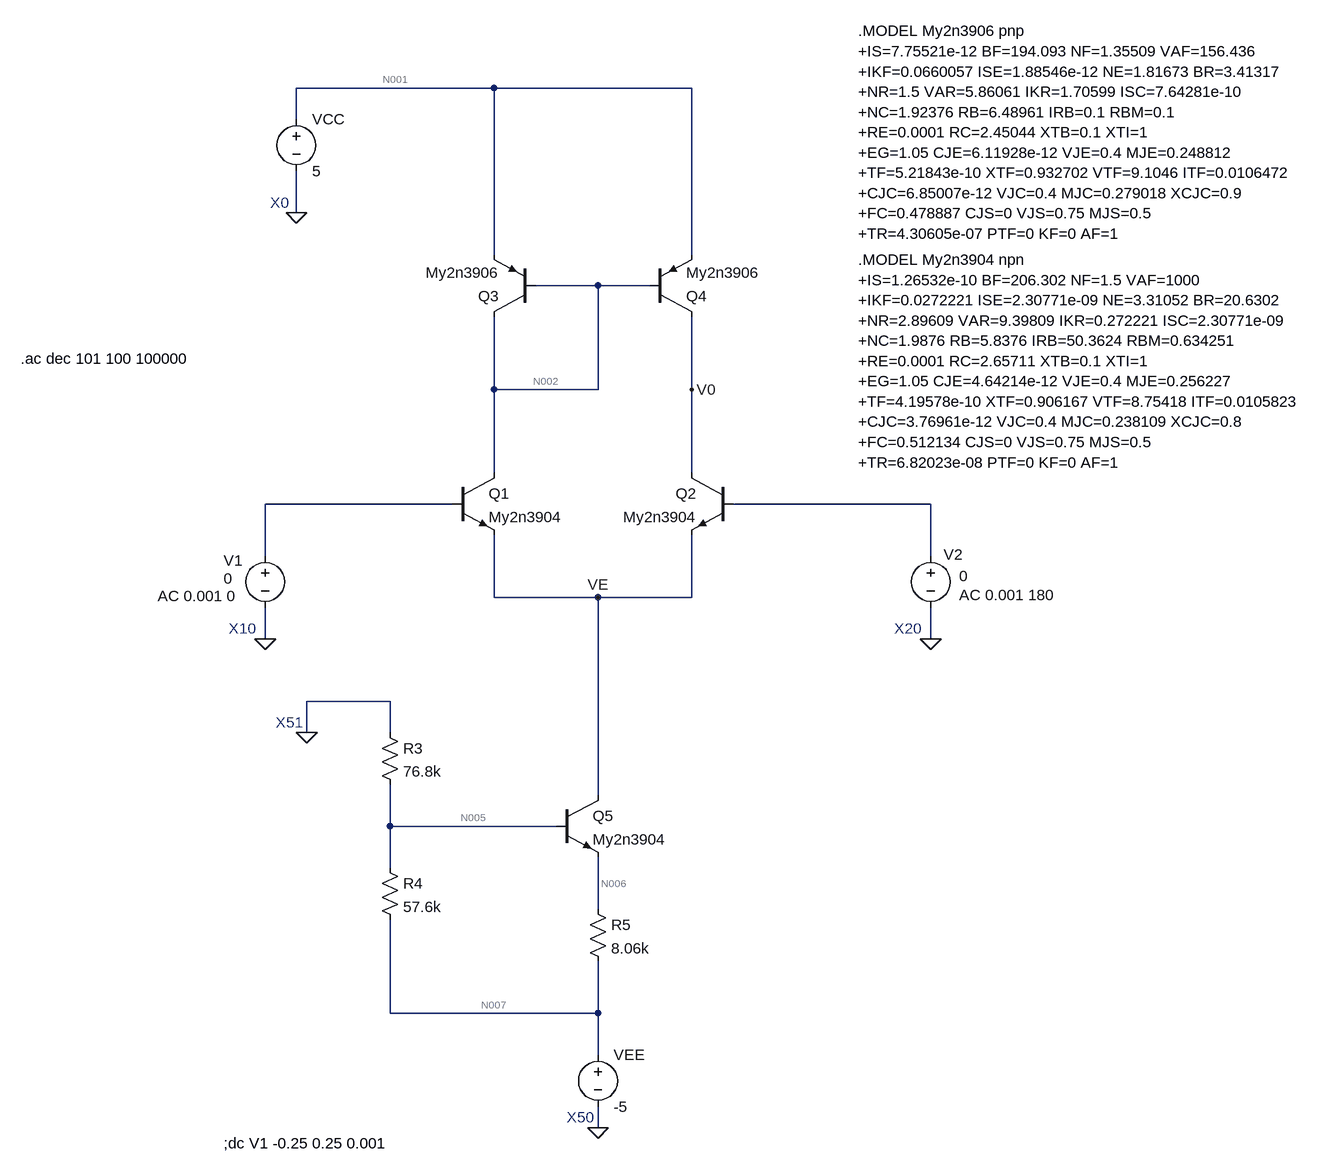
[diagram p0: schematic 3.1.asc]
3.1.asc, the LTspice schematic file:
Version 4
SHEET 1 1176 712
WIRE -128 -928 -432 -928
WIRE 176 -928 -128 -928
WIRE -432 -880 -432 -928
WIRE -432 -736 -432 -800
WIRE -128 -672 -128 -928
WIRE 176 -672 176 -928
WIRE 32 -624 -64 -624
WIRE 112 -624 32 -624
WIRE -128 -464 -128 -576
WIRE 32 -464 32 -624
WIRE 32 -464 -128 -464
WIRE 176 -464 176 -576
WIRE -128 -336 -128 -464
WIRE 176 -336 176 -464
WIRE -192 -288 -480 -288
WIRE 544 -288 240 -288
WIRE -480 -208 -480 -288
WIRE 544 -208 544 -288
WIRE -128 -144 -128 -240
WIRE 32 -144 -128 -144
WIRE 176 -144 176 -240
WIRE 176 -144 32 -144
WIRE -480 -80 -480 -128
WIRE 544 -80 544 -128
WIRE -288 16 -416 16
WIRE -416 64 -416 16
WIRE -288 64 -288 16
WIRE 32 160 32 -144
WIRE -288 208 -288 144
WIRE -32 208 -288 208
WIRE -288 272 -288 208
WIRE 32 336 32 256
WIRE -288 496 -288 352
WIRE 32 496 32 416
WIRE 32 496 -288 496
WIRE 32 560 32 496
WIRE 32 672 32 640
FLAG -432 -736 0
FLAG -480 -80 0
FLAG -416 64 0
FLAG 32 672 0
FLAG 32 -144 VE
FLAG 176 -464 V0
FLAG 544 -80 0
SYMBOL res -304 48 R0
SYMATTR InstName R3
SYMATTR Value 76.8k
SYMBOL res -304 256 R0
SYMATTR InstName R4
SYMATTR Value 57.6k
SYMBOL res 16 320 R0
SYMATTR InstName R5
SYMATTR Value 8.06k
SYMBOL voltage -432 -896 R0
WINDOW 123 0 0 Left 0
WINDOW 39 0 0 Left 0
SYMATTR InstName VCC
SYMATTR Value 5
SYMBOL npn -192 -336 R0
SYMATTR InstName Q1
SYMATTR Value My2n3904
SYMBOL npn 240 -336 M0
SYMATTR InstName Q2
SYMATTR Value My2n3904
SYMBOL voltage -480 -224 R0
WINDOW 0 -64 23 Left 2
WINDOW 3 -64 51 Left 2
WINDOW 123 -165 78 Left 2
WINDOW 39 0 0 Left 0
SYMATTR InstName V1
SYMATTR Value 0
SYMATTR Value2 AC 0.001 0
SYMBOL npn -32 160 R0
SYMATTR InstName Q5
SYMATTR Value My2n3904
SYMBOL voltage 32 544 R0
WINDOW 123 0 0 Left 0
WINDOW 39 0 0 Left 0
SYMATTR InstName VEE
SYMATTR Value -5
SYMBOL voltage 544 -224 R0
WINDOW 0 20 14 Left 2
WINDOW 3 44 47 Left 2
WINDOW 123 44 76 Left 2
WINDOW 39 0 0 Left 0
SYMATTR InstName V2
SYMATTR Value 0
SYMATTR Value2 AC 0.001 180
SYMBOL pnp -64 -576 R180
SYMATTR InstName Q3
SYMATTR Value My2n3906
SYMBOL pnp 112 -576 M180
SYMATTR InstName Q4
SYMATTR Value My2n3906
TEXT -472 -752 Left 2 ;X0
TEXT -536 -96 Left 2 ;X10
TEXT -464 48 Left 2 ;X51
TEXT -16 656 Left 2 ;X50
TEXT 432 -664 Left 2 !.MODEL My2n3904 npn\n+IS=1.26532e-10 BF=206.302 NF=1.5 VAF=1000\n+IKF=0.0272221 ISE=2.30771e-09 NE=3.31052 BR=20.6302\n+NR=2.89609 VAR=9.39809 IKR=0.272221 ISC=2.30771e-09\n+NC=1.9876 RB=5.8376 IRB=50.3624 RBM=0.634251\n+RE=0.0001 RC=2.65711 XTB=0.1 XTI=1\n+EG=1.05 CJE=4.64214e-12 VJE=0.4 MJE=0.256227\n+TF=4.19578e-10 XTF=0.906167 VTF=8.75418 ITF=0.0105823\n+CJC=3.76961e-12 VJC=0.4 MJC=0.238109 XCJC=0.8\n+FC=0.512134 CJS=0 VJS=0.75 MJS=0.5\n+TR=6.82023e-08 PTF=0 KF=0 AF=1
TEXT -544 696 Left 2 !;dc V1 -0.25 0.25 0.001
TEXT -856 -512 Left 2 !.ac dec 101 100 100000
TEXT 432 -1016 Left 2 !.MODEL My2n3906 pnp\n+IS=7.75521e-12 BF=194.093 NF=1.35509 VAF=156.436\n+IKF=0.0660057 ISE=1.88546e-12 NE=1.81673 BR=3.41317\n+NR=1.5 VAR=5.86061 IKR=1.70599 ISC=7.64281e-10\n+NC=1.92376 RB=6.48961 IRB=0.1 RBM=0.1\n+RE=0.0001 RC=2.45044 XTB=0.1 XTI=1\n+EG=1.05 CJE=6.11928e-12 VJE=0.4 MJE=0.248812\n+TF=5.21843e-10 XTF=0.932702 VTF=9.1046 ITF=0.0106472\n+CJC=6.85007e-12 VJC=0.4 MJC=0.279018 XCJC=0.9\n+FC=0.478887 CJS=0 VJS=0.75 MJS=0.5\n+TR=4.30605e-07 PTF=0 KF=0 AF=1
TEXT 488 -96 Left 2 ;X20

The netlist it stands for:
* 3.1.asc
R3 0 N005 76.8k
R4 N005 N007 57.6k
R5 N006 N007 8.06k
VCC N001 0 5
Q1 N002 N003 VE 0 My2n3904
Q2 V0 N004 VE 0 My2n3904
V1 N003 0 0 AC 0.001 0
Q5 VE N005 N006 0 My2n3904
VEE N007 0 -5
V2 N004 0 0 AC 0.001 180
Q3 N002 N002 N001 0 My2n3906
Q4 V0 N002 N001 0 My2n3906
.model NPN NPN
.model PNP PNP
.lib standard.bjt
* X0
* X10
* X51
* X50
.MODEL My2n3904 npn
+IS=1.26532e-10 BF=206.302 NF=1.5 VAF=1000
+IKF=0.0272221 ISE=2.30771e-09 NE=3.31052 BR=20.6302
+NR=2.89609 VAR=9.39809 IKR=0.272221 ISC=2.30771e-09
+NC=1.9876 RB=5.8376 IRB=50.3624 RBM=0.634251
+RE=0.0001 RC=2.65711 XTB=0.1 XTI=1
+EG=1.05 CJE=4.64214e-12 VJE=0.4 MJE=0.256227
+TF=4.19578e-10 XTF=0.906167 VTF=8.75418 ITF=0.0105823
+CJC=3.76961e-12 VJC=0.4 MJC=0.238109 XCJC=0.8
+FC=0.512134 CJS=0 VJS=0.75 MJS=0.5
+TR=6.82023e-08 PTF=0 KF=0 AF=1
;dc V1 -0.25 0.25 0.001
.ac dec 101 100 100000
.MODEL My2n3906 pnp
+IS=7.75521e-12 BF=194.093 NF=1.35509 VAF=156.436
+IKF=0.0660057 ISE=1.88546e-12 NE=1.81673 BR=3.41317
+NR=1.5 VAR=5.86061 IKR=1.70599 ISC=7.64281e-10
+NC=1.92376 RB=6.48961 IRB=0.1 RBM=0.1
+RE=0.0001 RC=2.45044 XTB=0.1 XTI=1
+EG=1.05 CJE=6.11928e-12 VJE=0.4 MJE=0.248812
+TF=5.21843e-10 XTF=0.932702 VTF=9.1046 ITF=0.0106472
+CJC=6.85007e-12 VJC=0.4 MJC=0.279018 XCJC=0.9
+FC=0.478887 CJS=0 VJS=0.75 MJS=0.5
+TR=4.30605e-07 PTF=0 KF=0 AF=1
* X20
.backanno
.end

* Results of the author's LTspice run, read from the files saved beside the schematic
* Operating Point, zero values left out:
*   V(n005) = -2.937 V
*   V(n007) = -5 V
*   V(n006) = -3.49 V
*   V(n001) = 5 V
*   V(n002) = 4.426 V
*   V(ve) = -525.4 mV
*   V(v0) = 1.992 V
*   Ic(Q4) = -90.79 µA
*   Ib(Q4) = -886.5 nA
*   Ie(Q4) = 91.68 µA
*   Ic(Q3) = -89.25 µA
*   Ib(Q3) = -887.2 nA
*   Ie(Q3) = 90.14 µA
*   Ic(Q5) = 184.9 µA
*   Ib(Q5) = 2.429 µA
*   Ie(Q5) = -187.3 µA
*   Ic(Q2) = 90.79 µA
*   Ib(Q2) = 1.529 µA
*   Ie(Q2) = -92.32 µA
*   Ic(Q1) = 91.02 µA
*   Ib(Q1) = 1.529 µA
*   Ie(Q1) = -92.55 µA
*   I(R5) = 187.3 µA
*   I(R4) = 35.81 µA
*   I(R3) = 38.24 µA
*   I(V2) = -1.529 µA
*   I(Vee) = 223.1 µA
*   I(V1) = -1.529 µA
*   I(Vcc) = -181.8 µA
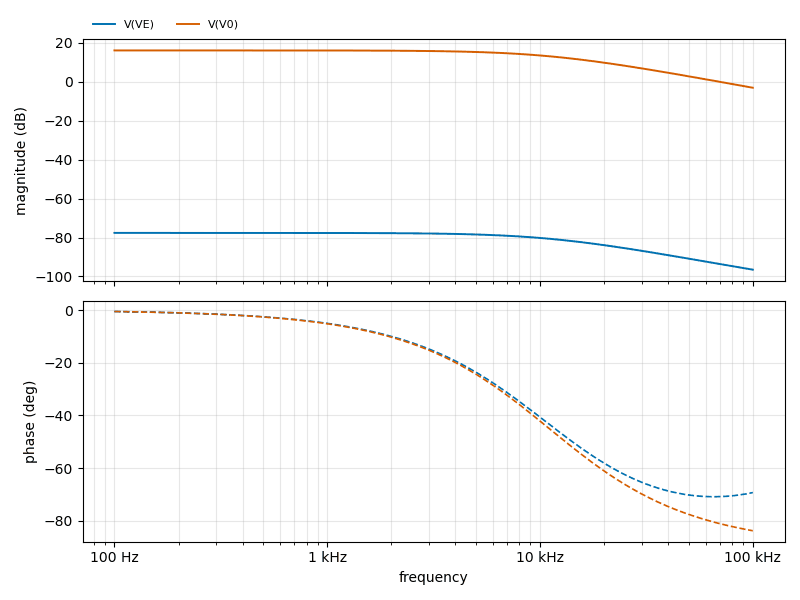
[diagram p1: AC Analysis of 3.1.asc, plotted from the saved traces]
* AC Analysis, 1 run:
*   V(VE): -77.62 dB at 100 Hz, -96.51 dB at 100 kHz, peak -77.62 dB at 100 Hz, 3 dB below the peak at 11.07 kHz
*   V(V0): 16.09 dB at 100 Hz, -3.08 dB at 100 kHz, peak 16.09 dB at 100 Hz, 3 dB below the peak at 11.06 kHz